# EAGLE schematic MOD-EEG-SMT (EAGLE 6.4)
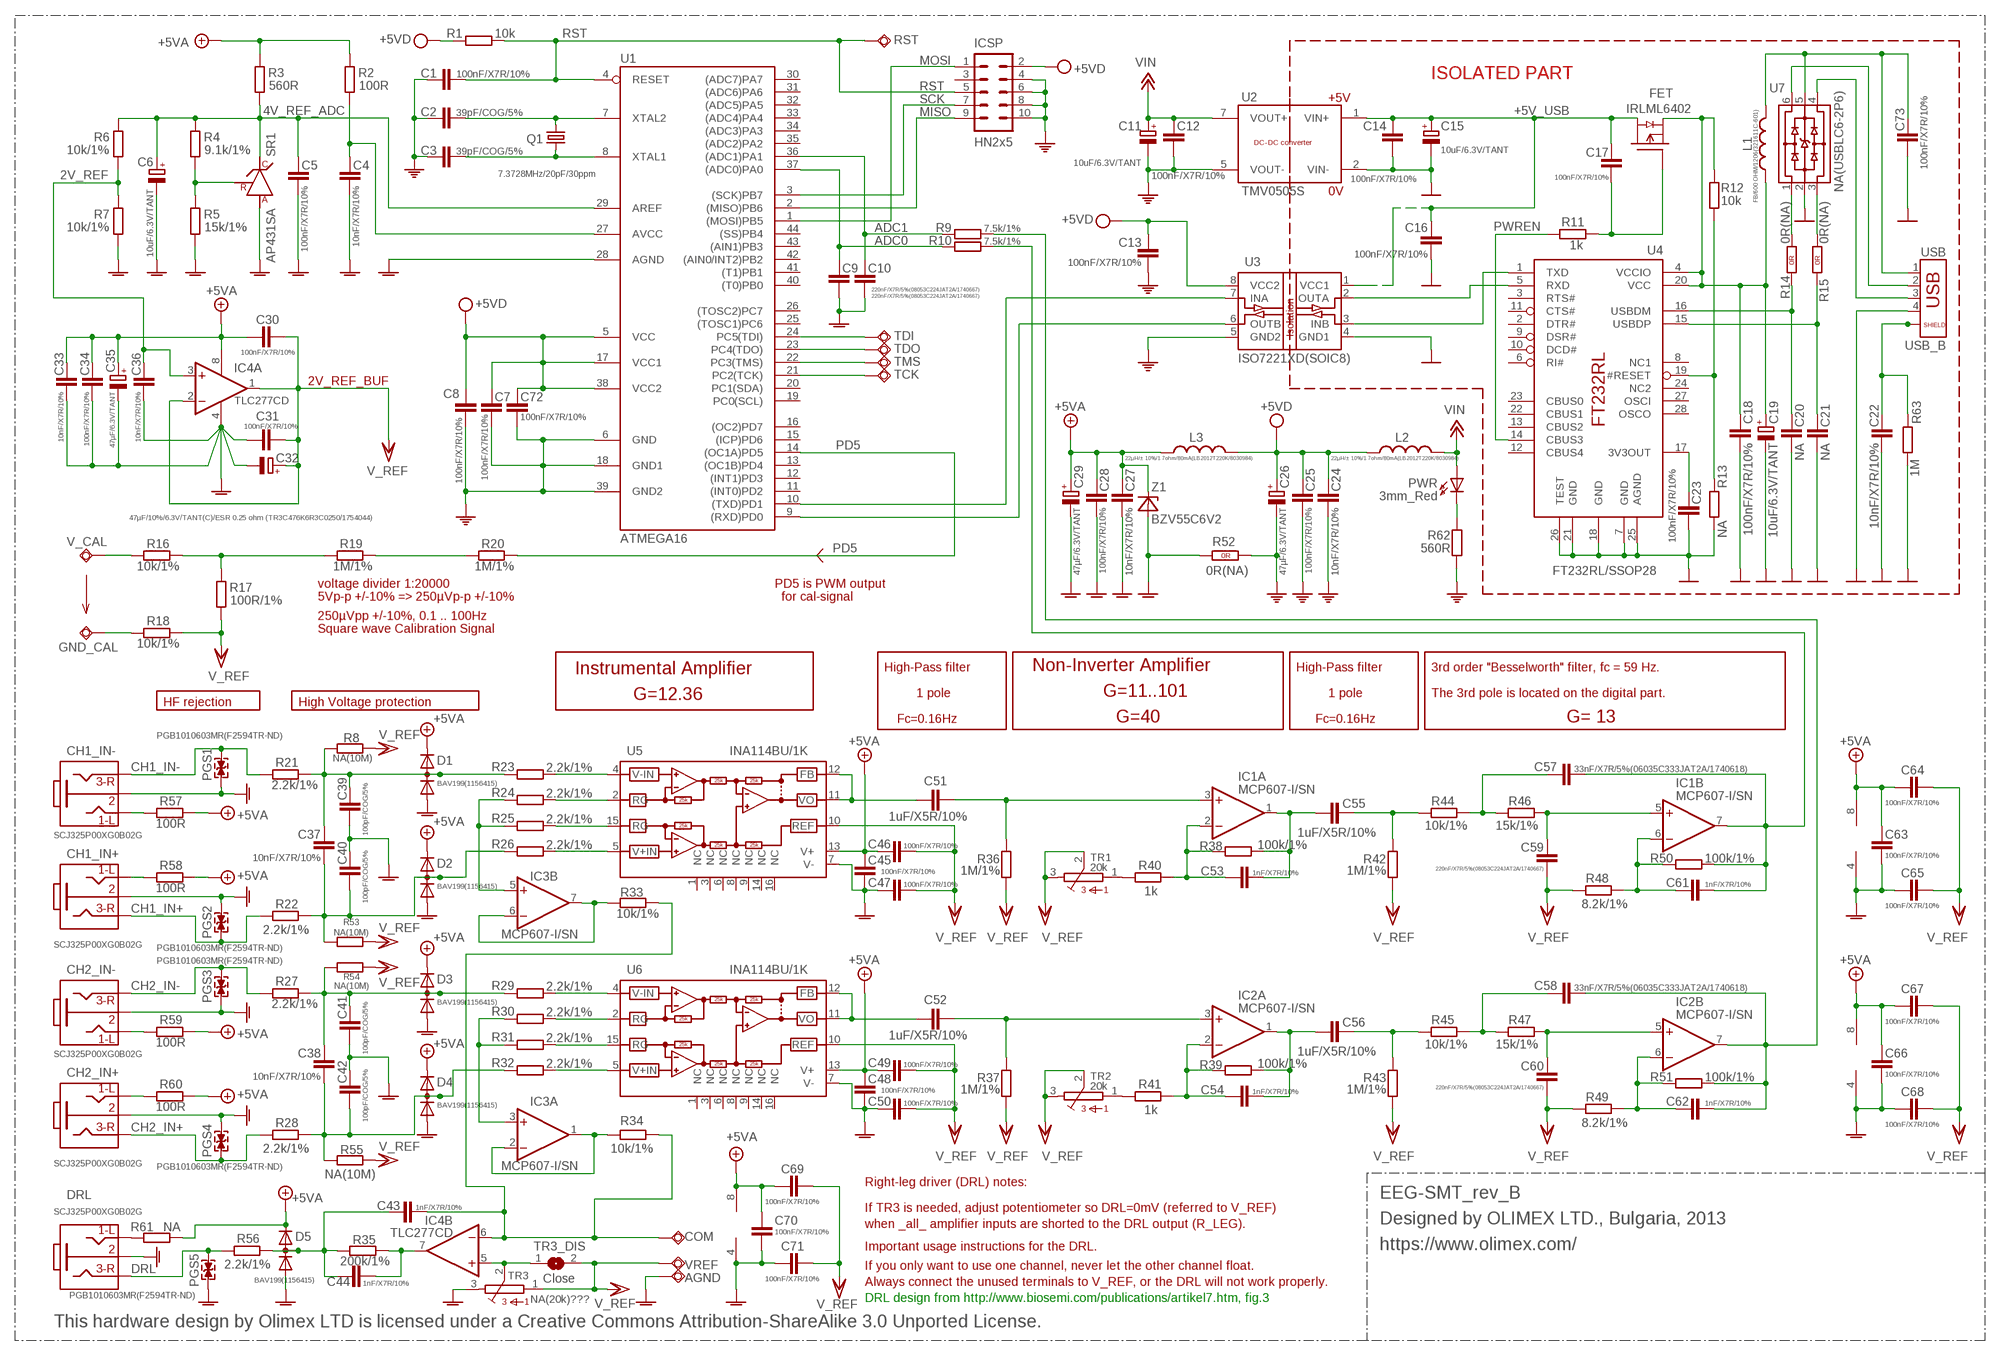
[diagram p0: schematic, sheet 1]

## Parts
AGND  TESTPAD3  [TEST_PAD40/70/SQUARE]
C1  100nF/X7R/10%  C-EUC0603_DWS  [C0603_DWS]
C2  39pF/COG/5%  C-EUC0603_DWS  [C0603_DWS]
C3  39pF/COG/5%  C-EUC0603_DWS  [C0603_DWS]
C4  10nF/X7R/10%  C-EUC0603_DWS  [C0603_DWS]
C5  100nF/X7R/10%  C-EUC0603_DWS  [C0603_DWS]
C6  10uF/6.3V/TANT  CPOL-EUCT3216  [CT3216]
C7  100nF/X7R/10%  C-EUC0603_DWS  [C0603_DWS]
C8  100nF/X7R/10%  C-EUC0603_DWS  [C0603_DWS]
C9  220nF/X7R/5%(08053C224JAT2A/1740667)  C-EUC0805_5MIL_DWS  [C0805_5MIL_DWS]
C10  220nF/X7R/5%(08053C224JAT2A/1740667)  C-EUC0805_5MIL_DWS  [C0805_5MIL_DWS]
C11  10uF/6.3V/TANT  CPOL-EUCT3216  [CT3216]
C12  100nF/X7R/10%  C-EUC0603_DWS  [C0603_DWS]
C13  100nF/X7R/10%  C-EUC0603_DWS  [C0603_DWS]
C14  100nF/X7R/10%  C-EUC0603_DWS  [C0603_DWS]
C15  10uF/6.3V/TANT  CPOL-EUCT3216  [CT3216]
C16  100nF/X7R/10%  C-EUC0603_DWS  [C0603_DWS]
C17  100nF/X7R/10%  C-EUC0603_DWS  [C0603_DWS]
C18  100nF/X7R/10%  C-EUC0603_DWS  [C0603_DWS]
C19  10uF/6.3V/TANT  CPOL-EUCT3216  [CT3216]
C20  NA  C-EUC0603_DWS_NA  [C0603_DWS_NA]
C21  NA  C-EUC0603_DWS_NA  [C0603_DWS_NA]
C22  10nF/X7R/10%  C-EUC0603_DWS  [C0603_DWS]
C23  100nF/X7R/10%  C-EUC0603_DWS  [C0603_DWS]
C24  10nF/X7R/10%  C-EUC0603_DWS  [C0603_DWS]
C25  100nF/X7R/10%  C-EUC0603_DWS  [C0603_DWS]
C26  47µF/6.3V/TANT  CPOL-EUCT3528  [CT3528]
C27  10nF/X7R/10%  C-EUC0603_DWS  [C0603_DWS]
C28  100nF/X7R/10%  C-EUC0603_DWS  [C0603_DWS]
C29  47µF/6.3V/TANT  CPOL-EUCT3528  [CT3528]
C30  100nF/X7R/10%  C-EUC0603_DWS  [C0603_DWS]
C31  100nF/X7R/10%  C-EUC0603_DWS  [C0603_DWS]
C32  47µF/10%/6.3V/TANT(C)/ESR 0.25 ohm (TR3C476K6R3C0250/1754044)  CPOL-EUCT6032  [CT6032]
C33  10nF/X7R/10%  C-EUC0603_DWS  [C0603_DWS]
C34  100nF/X7R/10%  C-EUC0603_DWS  [C0603_DWS]
C35  47µF/6.3V/TANT  CPOL-EUCT3528  [CT3528]
C36  10nF/X7R/10%  C-EUC0603_DWS  [C0603_DWS]
C37  10nF/X7R/10%  C-EUC0603_DWS  [C0603_DWS]
C38  10nF/X7R/10%  C-EUC0603_DWS  [C0603_DWS]
C39  100pF/COG/5%  C-EUC0603_DWS  [C0603_DWS]
C40  100pF/COG/5%  C-EUC0603_DWS  [C0603_DWS]
C41  100pF/COG/5%  C-EUC0603_DWS  [C0603_DWS]
C42  100pF/COG/5%  C-EUC0603_DWS  [C0603_DWS]
C43  1nF/X7R/10%  C-EUC0603_DWS  [C0603_DWS]
C44  1nF/X7R/10%  C-EUC0603_DWS  [C0603_DWS]
C45  100nF/X7R/10%  C-EUC0603_DWS  [C0603_DWS]
C46  100nF/X7R/10%  C-EUC0603_DWS  [C0603_DWS]
C47  100nF/X7R/10%  C-EUC0603_DWS  [C0603_DWS]
C48  100nF/X7R/10%  C-EUC0603_DWS  [C0603_DWS]
C49  100nF/X7R/10%  C-EUC0603_DWS  [C0603_DWS]
C50  100nF/X7R/10%  C-EUC0603_DWS  [C0603_DWS]
C51  1uF/X5R/10%  C-EUC0603_DWS  [C0603_DWS]
C52  1uF/X5R/10%  C-EUC0603_DWS  [C0603_DWS]
C53  1nF/X7R/10%  C-EUC0603_DWS  [C0603_DWS]
C54  1nF/X7R/10%  C-EUC0603_DWS  [C0603_DWS]
C55  1uF/X5R/10%  C-EUC0603_DWS  [C0603_DWS]
C56  1uF/X5R/10%  C-EUC0603_DWS  [C0603_DWS]
C57  33nF/X7R/5%(06035C333JAT2A/1740618)  C-EUC0603_DWS  [C0603_DWS]
C58  33nF/X7R/5%(06035C333JAT2A/1740618)  C-EUC0603_DWS  [C0603_DWS]
C59  220nF/X7R/5%(08053C224JAT2A/1740667)  C-EUC0805_5MIL_DWS  [C0805_5MIL_DWS]
C60  220nF/X7R/5%(08053C224JAT2A/1740667)  C-EUC0805_5MIL_DWS  [C0805_5MIL_DWS]
C61  1nF/X7R/10%  C-EUC0603_DWS  [C0603_DWS]
C62  1nF/X7R/10%  C-EUC0603_DWS  [C0603_DWS]
C63  100nF/X7R/10%  C-EUC0603_DWS  [C0603_DWS]
C64  100nF/X7R/10%  C-EUC0603_DWS  [C0603_DWS]
C65  100nF/X7R/10%  C-EUC0603_DWS  [C0603_DWS]
C66  100nF/X7R/10%  C-EUC0603_DWS  [C0603_DWS]
C67  100nF/X7R/10%  C-EUC0603_DWS  [C0603_DWS]
C68  100nF/X7R/10%  C-EUC0603_DWS  [C0603_DWS]
C69  100nF/X7R/10%  C-EUC0603_DWS  [C0603_DWS]
C70  100nF/X7R/10%  C-EUC0603_DWS  [C0603_DWS]
C71  100nF/X7R/10%  C-EUC0603_DWS  [C0603_DWS]
C72  100nF/X7R/10%  C-EUC0603_DWS  [C0603_DWS]
C73  100nF/X7R/10%  C-EUC0603_DWS  [C0603_DWS]
CH1_IN+  SCJ325P00XG0B02G  JACK-3PINPHONE_JACK-SMD  [PHONE_JACK-SMD]
CH1_IN-  SCJ325P00XG0B02G  JACK-3PINPHONE_JACK-SMD  [PHONE_JACK-SMD]
CH2_IN+  SCJ325P00XG0B02G  JACK-3PINPHONE_JACK-SMD  [PHONE_JACK-SMD]
CH2_IN-  SCJ325P00XG0B02G  JACK-3PINPHONE_JACK-SMD  [PHONE_JACK-SMD]
COM  TESTPAD3  [TEST_PAD40/70/SQUARE]
D1  BAV199(1156415)  DIODE_AC-AC_  [SOT23C(BAT54S)]
D2  BAV199(1156415)  DIODE_AC-AC_  [SOT23C(BAT54S)]
D3  BAV199(1156415)  DIODE_AC-AC_  [SOT23C(BAT54S)]
D4  BAV199(1156415)  DIODE_AC-AC_  [SOT23C(BAT54S)]
D5  BAV199(1156415)  DIODE_AC-AC_  [SOT23C(BAT54S)]
DRL  SCJ325P00XG0B02G  JACK-3PINPHONE_JACK-SMD  [PHONE_JACK-SMD]
FET  IRLML6402  [SOT23]
GND_CAL  TESTPAD3  [TEST_PAD40/70/SQUARE]
IC1  MCP607-I/SN  LM358D  [SO08]
IC2  MCP607-I/SN  LM358D  [SO08]
IC3  MCP607-I/SN  LM358D  [SO08]
IC4  TLC277CD  LM358D  [SO08]
ICSP  HN2x5  ML10ML10_NEW  [ML10_NEW]
L1  FB/600 OHM/1206(321611C-601)  L-US1206_5MIL  [L1206_5MIL]
L2  22µH/± 10%/1.7ohm/80mA(LB2012T220K/8030984)  L-USL0805_5MIL_DWS  [L0805_5MIL_DWS]
L3  22µH/± 10%/1.7ohm/80mA(LB2012T220K/8030984)  L-USL0805_5MIL_DWS  [L0805_5MIL_DWS]
PGS1  PGB1010603MR(F2594TR-ND)  [0603]
PGS2  PGB1010603MR(F2594TR-ND)  [0603]
PGS3  PGB1010603MR(F2594TR-ND)  [0603]
PGS4  PGB1010603MR(F2594TR-ND)  [0603]
PGS5  PGB1010603MR(F2594TR-ND)  [0603]
PWR  3mm_Red  LED3.0MM  [LED-3.0MM]
Q1  7.3728MHz/20pF/30ppm  HC49/S1  [HC49/SMD2_THIN]
R1  10k  R-EU_R0603_5MIL_DWS  [R0603_5MIL_DWS]
R2  100R  R-EU_R0603_5MIL_DWS  [R0603_5MIL_DWS]
R3  560R  R-EU_R0603_5MIL_DWS  [R0603_5MIL_DWS]
R4  9.1k/1%  R-EU_R0603_5MIL_DWS  [R0603_5MIL_DWS]
R5  15k/1%  R-EU_R0603_5MIL_DWS  [R0603_5MIL_DWS]
R6  10k/1%  R-EU_R0603_5MIL_DWS  [R0603_5MIL_DWS]
R7  10k/1%  R-EU_R0603_5MIL_DWS  [R0603_5MIL_DWS]
R8  NA(10M)  R-EU_R0603_5MIL_DWS  [R0603_5MIL_DWS]
R9  7.5k/1%  R-EU_R0603_5MIL_DWS  [R0603_5MIL_DWS]
R10  7.5k/1%  R-EU_R0603_5MIL_DWS  [R0603_5MIL_DWS]
R11  1k  R-EU_R0603_5MIL_DWS  [R0603_5MIL_DWS]
R12  10k  R-EU_R0603_5MIL_DWS  [R0603_5MIL_DWS]
R13  NA  R-EU_R0603_5MIL_DWS_NA  [R0603_5MIL_DWS_NA]
R14  0R(NA)  R_0R0R(NA)  [0603_0R]
R15  0R(NA)  R_0R0R(NA)  [0603_0R]
R16  10k/1%  R-EU_R0603_5MIL_DWS  [R0603_5MIL_DWS]
R17  100R/1%  R-EU_R0603_5MIL_DWS  [R0603_5MIL_DWS]
R18  10k/1%  R-EU_R0603_5MIL_DWS  [R0603_5MIL_DWS]
R19  1M/1%  R-EU_R0603_5MIL_DWS  [R0603_5MIL_DWS]
R20  1M/1%  R-EU_R0603_5MIL_DWS  [R0603_5MIL_DWS]
R21  2.2k/1%  R-EU_R0603_5MIL_DWS  [R0603_5MIL_DWS]
R22  2.2k/1%  R-EU_R0603_5MIL_DWS  [R0603_5MIL_DWS]
R23  2.2k/1%  R-EU_R0603_5MIL_DWS  [R0603_5MIL_DWS]
R24  2.2k/1%  R-EU_R0603_5MIL_DWS  [R0603_5MIL_DWS]
R25  2.2k/1%  R-EU_R0603_5MIL_DWS  [R0603_5MIL_DWS]
R26  2.2k/1%  R-EU_R0603_5MIL_DWS  [R0603_5MIL_DWS]
R27  2.2k/1%  R-EU_R0603_5MIL_DWS  [R0603_5MIL_DWS]
R28  2.2k/1%  R-EU_R0603_5MIL_DWS  [R0603_5MIL_DWS]
R29  2.2k/1%  R-EU_R0603_5MIL_DWS  [R0603_5MIL_DWS]
R30  2.2k/1%  R-EU_R0603_5MIL_DWS  [R0603_5MIL_DWS]
R31  2.2k/1%  R-EU_R0603_5MIL_DWS  [R0603_5MIL_DWS]
R32  2.2k/1%  R-EU_R0603_5MIL_DWS  [R0603_5MIL_DWS]
R33  10k/1%  R-EU_R0603_5MIL_DWS  [R0603_5MIL_DWS]
R34  10k/1%  R-EU_R0603_5MIL_DWS  [R0603_5MIL_DWS]
R35  200k/1%  R-EU_R0603_5MIL_DWS  [R0603_5MIL_DWS]
R36  1M/1%  R-EU_R0603_5MIL_DWS  [R0603_5MIL_DWS]
R37  1M/1%  R-EU_R0603_5MIL_DWS  [R0603_5MIL_DWS]
R38  100k/1%  R-EU_R0603_5MIL_DWS  [R0603_5MIL_DWS]
R39  100k/1%  R-EU_R0603_5MIL_DWS  [R0603_5MIL_DWS]
R40  1k  R-EU_R0603_5MIL_DWS  [R0603_5MIL_DWS]
R41  1k  R-EU_R0603_5MIL_DWS  [R0603_5MIL_DWS]
R42  1M/1%  R-EU_R0603_5MIL_DWS  [R0603_5MIL_DWS]
R43  1M/1%  R-EU_R0603_5MIL_DWS  [R0603_5MIL_DWS]
R44  10k/1%  R-EU_R0603_5MIL_DWS  [R0603_5MIL_DWS]
R45  10k/1%  R-EU_R0603_5MIL_DWS  [R0603_5MIL_DWS]
R46  15k/1%  R-EU_R0603_5MIL_DWS  [R0603_5MIL_DWS]
R47  15k/1%  R-EU_R0603_5MIL_DWS  [R0603_5MIL_DWS]
R48  8.2k/1%  R-EU_R0603_5MIL_DWS  [R0603_5MIL_DWS]
R49  8.2k/1%  R-EU_R0603_5MIL_DWS  [R0603_5MIL_DWS]
R50  100k/1%  R-EU_R0603_5MIL_DWS  [R0603_5MIL_DWS]
R51  100k/1%  R-EU_R0603_5MIL_DWS  [R0603_5MIL_DWS]
R52  0R(NA)  R_0R0R(NA)  [0603_0R]
R53  NA(10M)  R-EU_R0603_5MIL_DWS  [R0603_5MIL_DWS]
R54  NA(10M)  R-EU_R0603_5MIL_DWS  [R0603_5MIL_DWS]
R55  NA(10M)  R-EU_R0603_5MIL_DWS  [R0603_5MIL_DWS]
R56  2.2k/1%  R-EU_R0603_5MIL_DWS  [R0603_5MIL_DWS]
R57  100R  R-EU_R0603_5MIL_DWS  [R0603_5MIL_DWS]
R58  100R  R-EU_R0603_5MIL_DWS  [R0603_5MIL_DWS]
R59  100R  R-EU_R0603_5MIL_DWS  [R0603_5MIL_DWS]
R60  100R  R-EU_R0603_5MIL_DWS  [R0603_5MIL_DWS]
R61  NA  R-EU_R0603_5MIL_DWS_NA  [R0603_5MIL_DWS_NA]
R62  560R  R-EU_R0603_5MIL_DWS  [R0603_5MIL_DWS]
R63  1M  R-EU_R0603_5MIL_DWS  [R0603_5MIL_DWS]
RST  TESTPAD80/30  [SMD80/30]
SR1  AP431SA  TL431'''  [SOT-23]
TCK  TESTPAD80/30  [SMD80/30]
TDI  TESTPAD80/30  [SMD80/30]
TDO  TESTPAD80/30  [SMD80/30]
TMS  TESTPAD80/30  [SMD80/30]
TR1  20k  S64Y  [S64Y]
TR2  20k  S64Y  [S64Y]
TR3  NA(20k)???  S64Y  [S64Y]
TR3_DIS  Close  SJSJ_SMALLER  [SJ_1_SMALLER]
U1  ATMEGA16  [44TQFP]
U2  TMV0505S  TMV0505  [TMADCDC]
U3  ISO7221XD(SOIC8)  ISO7221XD  [SO-8_ISOLATE]
U4  FT232RL/SSOP28  FT232RLSSOP28  [SSOP28]
U5  INA114BU/1K  [SO16]
U6  INA114BU/1K  [SO16]
U7  NA(USBLC6-2P6)  USBLC6-2  [USBLC6-2P6]
USB  USB_B  USB_SHIELD  [USB_NEAR_BLACK]
V_CAL  TESTPAD3  [TEST_PAD40/70/SQUARE]
VREF  TESTPAD3  [TEST_PAD40/70/SQUARE]
Z1  BZV55C6V2  ZDIOD-SMD  [MINI-MELF]

## Nets
2V_REF: C36.1 IC4.3(A:+IN) R6.1 R7.2
4V_REF_ADC: C5.1 C6.+ R3.1 R4.2 R6.2 SR1.1(C) U1.29(AREF)
+5V: C27.1 C28.1 C29.+ C30.2 C33.1 C34.1 C35.+ C45.1 C46.1 C48.1 C49.1 C63.1 C64.1 C66.1 C67.1 C69.1 C70.1 D1.2(K) D2.2(K) D3.2(K) D4.2(K) D5.2(K) IC1.8(P:V+) IC2.8(P:V+) IC3.8(P:V+) IC4.8(P:V+) L3.2 R2.2 R3.2 R57.2 R58.2 R59.2 R60.2 R61.2 U5.13(V+) U6.13(V+) Z1.1(C) ; supply symbol labelled +5VA
+5V_USB: C14.1 C15.+ C16.1 C17.1 FET.3(D) U2.1(VIN+) U3.1(VCC1)
+12V: C11.+ C12.1 L2.1 PWR.A U2.7(VOUT+) ; supply symbol labelled VIN
ADC0: C9.1 R10.1 U1.37((ADC0)PA0)
ADC1: C10.1 R9.1 U1.36((ADC1)PA1)
CH1_IN+: CH1_IN+.2 PGS2.1 R22.1
CH1_IN-: CH1_IN-.2 PGS1.2 R21.1
CH2_IN+: CH2_IN+.2 PGS4.1 R28.1
CH2_IN-: CH2_IN-.2 PGS3.2 R27.1
DRL: DRL.2 PGS5.2 R56.1
GND: C14.2 C15.- C16.2 C18.2 C19.- C20.2 C21.2 C22.2 C23.2 C73.2 R13.1 R63.1 U2.2(VIN-) U3.4(GND1) U4.7(GND) U4.18(GND) U4.21(GND) U4.25(AGND) U4.26(TEST) U7.2 USB.4
GNDA [pwr]: AGND.P$1(PP) C4.2 C5.2 C6.- C9.2 C10.2 C27.2 C28.2 C29.- C31.2 C32.- C33.2 C34.2 C35.- C36.2 C39.1 C40.2 C41.1 C42.2 C45.2 C47.1 C48.2 C50.1 C63.2 C65.1 C66.2 C68.1 C70.2 C71.1 CH1_IN+.1 CH1_IN-.1 CH2_IN+.1 CH2_IN-.1 D1.1(A) D2.1(A) D3.1(A) D4.1(A) D5.1(A) DRL.1 IC1.4(P:V-) IC2.4(P:V-) IC3.4(P:V-) IC4.4(P:V-) PGS1.1 PGS2.2 PGS3.1 PGS4.2 PGS5.1 R5.1 R7.1 R52.1(1.1) SR1.3(A) TR3.3 U1.28(AGND) U5.7(V-) U6.7(V-) Z1.2(A)
MISO: ICSP.9 U1.2((MISO)PB6)
MOSI: ICSP.1 U1.1((MOSI)PB5)
N$1: R14.1(1.1) U7.1
N$2: R15.1(1.1) U7.3
N$3: TDI.P$1(PP) U1.24(PC5(TDI))
N$4: TDO.P$1(PP) U1.23(PC4(TDO))
N$5: TMS.P$1(PP) U1.22(PC3(TMS))
N$6: TCK.P$1(PP) U1.21(PC2(TCK))
N$7: CH1_IN-.5 R57.1
N$8: CH1_IN+.5 R58.1
N$9: C43.2 C44.2 D5.3(AK) R35.1 R56.2
N$10: CH2_IN+.5 R60.1
N$11: CH2_IN-.5 R59.1
N$12: DRL.5 R61.1
N$15: PWR.K(C) R62.2
N$16: U3.2(OUTA) U4.5(RXD)
N$17: C22.1 R63.2 USB.P$1 USB.P$2
N$18: U7.6 USB.2
N$20: U3.3(INB) U4.1(TXD)
N$21: C4.1 R2.1 U1.27(AVCC)
N$22: R4.1 R5.2 SR1.2(R)
N$23: U1.10((TXD)PD1) U3.7(INA)
N$24: U1.9((RXD)PD0) U3.6(OUTB)
N$25: U7.4 USB.3
N$26: C73.1 L1.1 U7.5 USB.1
N$27: C3.1 Q1.2 U1.8(XTAL1)
N$28: C2.1 Q1.1 U1.7(XTAL2)
N$29: R40.2 TR1.1
N$30: R41.2 TR2.1
N$35: R12.1 R13.2 U4.19(#RESET)
N$78: C23.1 U4.17(3V3OUT)
N$79: C18.1 C19.+ FET.2(S) L1.2 R12.2 U4.4(VCCIO) U4.20(VCC)
N$81: C55.2 R42.1 R44.1
N$83: C51.1 U5.11(VO) U5.12(FB)
N$84: R23.1 U5.4(V-IN)
N$88: R24.1 U5.2(RG)
N$92: C37.1 C40.1 D2.3(AK) R22.2 R26.2 R53.2
N$93: C37.2 C39.2 D1.3(AK) R8.2 R21.2 R23.2
N$94: C38.1 C42.1 D4.3(AK) R28.2 R32.2 R55.2
N$95: C38.2 C41.2 D3.3(AK) R27.2 R29.2 R54.2
N$101: R25.1 U5.15(RG)
N$102: C51.2 IC1.3(A:+IN) R36.1
N$103: IC3.5(B:+IN) R24.2 R25.2
N$104: C53.2 C55.1 IC1.1(A:OUT) R38.2
N$105: C53.1 IC1.2(A:-IN) R38.1 R40.1
N$106: R26.1 U5.5(V+IN)
N$107: C59.1 IC1.5(B:+IN) R46.2
N$108: C57.1 R44.2 R46.1
N$109: C57.2 C61.2 IC1.7(B:OUT) R10.2 R50.2
N$110: C61.1 IC1.6(B:-IN) R48.1 R50.1
N$113: C52.2 IC2.3(A:+IN) R37.1
N$125: C54.2 C56.1 IC2.1(A:OUT) R39.2
N$126: C54.1 IC2.2(A:-IN) R39.1 R41.1
N$127: C60.1 IC2.5(B:+IN) R47.2
N$128: C58.1 R45.2 R47.1
N$129: C58.2 C62.2 IC2.7(B:OUT) R9.2 R51.2
N$130: C62.1 IC2.6(B:-IN) R49.1 R51.1
N$131: C56.2 R43.1 R45.1
N$133: C52.1 U6.11(VO) U6.12(FB)
N$134: R30.1 U6.2(RG)
N$135: R31.1 U6.15(RG)
N$136: IC3.3(A:+IN) R30.2 R31.2
N$137: R29.1 U6.4(V-IN)
N$138: R32.1 U6.5(V+IN)
N$139: IC3.1(A:OUT) IC3.2(A:-IN) R34.2
N$140: IC3.6(B:-IN) IC3.7(B:OUT) R33.2
N$141: IC4.5(B:+IN) TR3.2 TR3_DIS.1
N$142: C44.1 IC4.7(B:OUT) R35.2
N$144: R19.2 R20.1
N$145: C43.1 COM.P$1(PP) IC4.6(B:-IN) R33.1 R34.1
N$146: R16.2 R17.2 R19.1
N$148: R16.1 V_CAL.P$1(PP)
N$149: GND_CAL.P$1(PP) R18.1
N$168: C17.2 FET.1(G) R11.2
PD5: R20.2 U1.14((OC1A)PD5)
PE: C1.2 C2.2 C3.2 C7.2 C8.2 C11.- C12.2 C13.2 C24.2 C25.2 C26.- C72.2 ICSP.4 ICSP.6 ICSP.8 ICSP.10 R52.2(1.2) R62.1 U1.6(GND) U1.18(GND1) U1.39(GND2) U2.5(VOUT-) U3.5(GND2)
PWREN: R11.1 U4.14(CBUS3)
RST: C1.1 ICSP.5 R1.2 RST.P$1(PP) U1.4(RESET)
SCK: ICSP.7 U1.3((SCK)PB7)
USBDM: C20.1 R14.2(1.2) U4.16(USBDM)
USBDP: C21.1 R15.2(1.2) U4.15(USBDP)
VCC/2: C30.1 C31.1 C32.+ C46.2 C47.2 C49.2 C50.2 C59.2 C60.2 C64.2 C65.2 C67.2 C68.2 C69.2 C71.2 IC4.1(A:OUT) IC4.2(A:-IN) R8.1 R17.1 R18.2 R36.2 R37.2 R42.2 R43.2 R48.2 R49.2 R53.1 R54.1 R55.1 TR1.2 TR1.3 TR2.2 TR2.3 TR3.1 TR3_DIS.2 U5.10(REF) U6.10(REF) VREF.P$1(PP) ; supply symbol labelled V_REF
VPP: C7.1 C8.1 C13.1 C24.1 C25.1 C26.+ C72.1 ICSP.2 L2.2 L3.1 R1.1 U1.5(VCC) U1.17(VCC1) U1.38(VCC2) U3.8(VCC2) ; supply symbol labelled +5VD
Unconnected: ICSP.3 U1.11((INT0)PD2) U1.12((INT1)PD3) U1.13((OC1B)PD4) U1.15((ICP)PD6) U1.16((OC2)PD7) U1.19(PC0(SCL)) U1.20(PC1(SDA)) U1.25((TOSC1)PC6) U1.26((TOSC2)PC7) U1.30((ADC7)PA7) U1.31((ADC6)PA6) U1.32((ADC5)PA5) U1.33((ADC4)PA4) U1.34((ADC3)PA3) U1.35((ADC2)PA2) U1.40((T0)PB0) U1.41((T1)PB1) U1.42((AIN0/INT2)PB2) U1.43((AIN1)PB3) U1.44((SS)PB4) U4.2(DTR#) U4.3(RTS#) U4.6(RI#) U4.8(NC1) U4.9(DSR#) U4.10(DCD#) U4.11(CTS#) U4.12(CBUS4) U4.13(CBUS2) U4.22(CBUS1) U4.23(CBUS0) U4.24(NC2) U4.27(OSCI) U4.28(OSCO) U5.1(NC) U5.3(NC) U5.6(NC) U5.8(NC) U5.9(NC) U5.14(NC) U5.16(NC) U6.1(NC) U6.3(NC) U6.6(NC) U6.8(NC) U6.9(NC) U6.14(NC) U6.16(NC)

## Notes on the sheet
- ISOLATED PART
- +5V
- 0V
- 2V_REF_BUF
- voltage divider 1:20000 | PD5 is PWM output
- 5Vp-p +/-10% => 250µVp-p +/-10% | for cal-signal
- 250µVpp +/-10%, 0.1 .. 100Hz
- Square wave Calibration Signal
- Instrumental Amplifier | High-Pass filter | Non-Inverter Amplifier | High-Pass filter | 3rd order "Besselworth" filter, fc = 59 Hz.
- HF rejection | High Voltage protection | G=12.36 | 1 pole | G=11..101 | 1 pole | The 3rd pole is located on the digital part.
- Fc=0.16Hz | G=40 | Fc=0.16Hz | G= 13
- Right-leg driver (DRL) notes:
- EEG-SMT_rev_B
- If TR3 is needed, adjust potentiometer so DRL=0mV (referred to V_REF)
- when _all_ amplifier inputs are shorted to the DRL output (R_LEG). | Designed by OLIMEX LTD., Bulgaria, 2013
- Important usage instructions for the DRL. | https://www.olimex.com/
- If you only want to use one channel, never let the other channel float.
- Always connect the unused terminals to V_REF, or the DRL will not work properly.
- DRL design from http://www.biosemi.com/publications/artikel7.htm, fig.3
- This hardware design by Olimex LTD is licensed under a Creative Commons Attribution-ShareAlike 3.0 Unported License.

## Library data of the parts
AGND COM GND_CAL RST TCK TDI TDO TMS V_CAL VREF = gogo:TESTPAD: drill 40mils, diameter 70mils
C1-C5 C7-C10 C12-C14 C16-C18 C20-C25 C27 C28 C30 C31 C33 C34 C36-C73 = rcl:C-EU: CAPACITOR, European symbol
C6 C11 C15 C19 C26 C29 C32 C35 = rcl:CPOL-EU: POLARIZED CAPACITOR, European symbol
CH1_IN+ CH1_IN- CH2_IN+ CH2_IN- DRL = gogo:JACK-3PIN
D1-D5 = semicon-smd-ipc:DIODE_AC-AC_: DUAL DIODE
FET = gogo:IRLML6402
IC1-IC4 = linear:LM358: OP AMP
ICSP = con-harting-ml:ML10: HARTING
L1-L3 = rcl:L-US: INDUCTOR, American symbol
PGS1-PGS5 = OLIMEX_DISCRET:PGB1010603MR: PulseGuard® Suppressors Surface Mount Polymeric ESD Suppressors
PWR = DOUBLE-SIDE:LED
Q1 = crystal:HC49/S: CRYSTAL
R1-R13 R16-R51 R53-R63 = rcl:R-EU_: RESISTOR, European symbol
R14 R15 R52 = OLIMEX_DISCRET:R_0R
SR1 = OLIMEX_IC:TL431: TL431 Programmable Shunt Regulator Features: -> Programmable Output Voltage to 36 Volts -> Low Dynamic Output Impedance 0.20 Typical -> Sink Current Capability of 1.0 to 100mA -> Equivalent Full-Range Temperature Coefficient of 50ppm/°C Typical -> Temperature Compensated For Operation Over Full Rated Operating Temperature Range -> Low Output Noise Voltage -> Fast Turn-on Response
TR1-TR3 = TRIMPOT:S64Y
TR3_DIS = jumper:SJ: SMD solder JUMPER
U1 = gogo:ATMEGA16
U2 = MODEEG:TMV0505
U3 = OLIMEX_IC:ISO7221XD: ISO7221 - dual-channel digital isolator FEATURES: -> 1, 25, and 150-Mbps Signaling Rate Options; -> Low Channel-to-Channel Output Skew - 1 ns max; -> Low Pulse-Width Distortion (PWD) - 1 ns max; -> Low Jitter Content - 1 ns Typ at 150 Mbps; -> Typical 25-Year Life at Rated Voltage; -> 4000-Vpeak Isolation, 560 V peak VIORM - 50 kV/?s Typical Transient Immunity; -> Operates with 3.3-V or 5-V Supplies; -> 4 kV ESD Protection; -> High Electromagnetic Immunity; -> ?40°C to 125°C Operating Range;
U4 = OLIMEX_IC:FT232RL
U5 U6 = OLIMEX_IC:INA114
U7 = OLIMEX_IC:USBLC6-2
USB = OLIMEX_CONNECTORS:USB_SHIELD
Z1 = gogo:ZDIOD-SMD

## Net classes
1 pwr: width 0.4 mm, clearance 0.23 mm